# EAGLE design Interconnect_board_v2p0 (EAGLE 9.5.1)
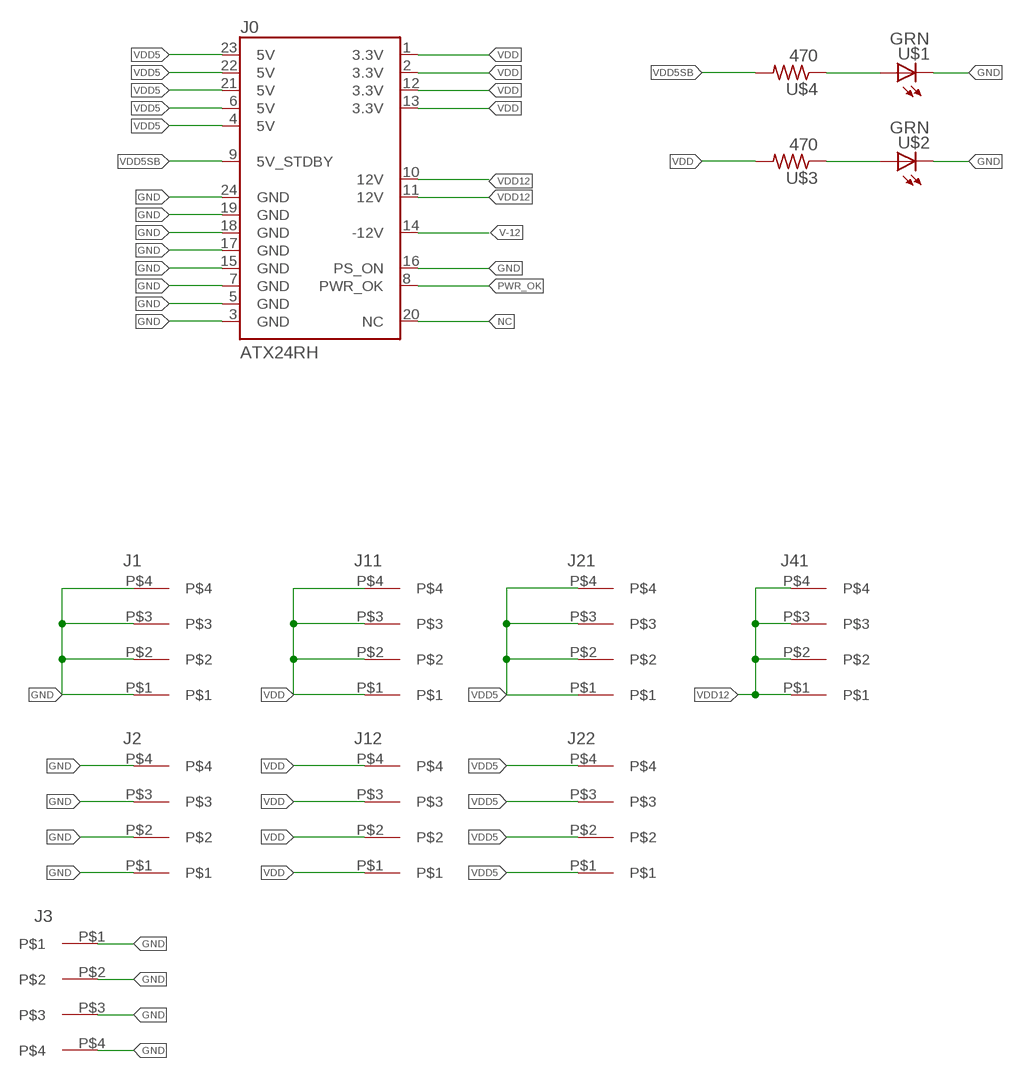
[diagram p0: schematic, sheet 1]

## Parts
J0  ATX24RH  [ATX24_RIGHT_ANGLE]
J1  3.81MM_1_X_4_RT_ANGLE_PLUG_HEADER  [1X4_3.81MM_PITCH]
J2  3.81MM_1_X_4_RT_ANGLE_PLUG_HEADER  [1X4_3.81MM_PITCH]
J3  3.81MM_1_X_4_RT_ANGLE_PLUG_HEADER  [1X4_3.81MM_PITCH]
J11  3.81MM_1_X_4_RT_ANGLE_PLUG_HEADER  [1X4_3.81MM_PITCH]
J12  3.81MM_1_X_4_RT_ANGLE_PLUG_HEADER  [1X4_3.81MM_PITCH]
J21  3.81MM_1_X_4_RT_ANGLE_PLUG_HEADER  [1X4_3.81MM_PITCH]
J22  3.81MM_1_X_4_RT_ANGLE_PLUG_HEADER  [1X4_3.81MM_PITCH]
J41  3.81MM_1_X_4_RT_ANGLE_PLUG_HEADER  [1X4_3.81MM_PITCH]
U$1  LED_0805_GREEN  [LED_0805_GREEN]
U$2  LED_0805_GREEN  [LED_0805_GREEN]
U$3  R_0805_470  [R_0805_470]
U$4  R_0805_470  [R_0805_470]

## Nets
GND: J0.3(GND) J0.5(GND) J0.7(GND) J0.15(GND) J0.16(PS_ON) J0.17(GND) J0.18(GND) J0.19(GND) J0.24(GND) J1.P$1 J1.P$2 J1.P$3 J1.P$4 J2.P$1 J2.P$2 J2.P$3 J2.P$4 J3.P$1 J3.P$2 J3.P$3 J3.P$4 U$1.C U$2.C
N$4: U$1.A U$4.1
N$5: U$2.A U$3.1
NC: J0.20(NC)
PWR_OK: J0.8(PWR_OK)
V-12: J0.14(-12V)
VDD: J0.1(3.3V) J0.2(3.3V) J0.12(3.3V) J0.13(3.3V) J11.P$1 J11.P$2 J11.P$3 J11.P$4 J12.P$1 J12.P$2 J12.P$3 J12.P$4 U$3.2
VDD5: J0.4(5V) J0.6(5V) J0.21(5V) J0.22(5V) J0.23(5V) J21.P$1 J21.P$2 J21.P$3 J21.P$4 J22.P$1 J22.P$2 J22.P$3 J22.P$4
VDD5SB: J0.9(5V_STDBY) U$4.2
VDD12: J0.10(12V) J0.11(12V) J41.P$1 J41.P$2 J41.P$3 J41.P$4

## Library data of the parts
J0 = 3D_MIG_Controller:ATX24: ATX24 Pin Power Supply Connector - Right Angle PTH Mount This is a good connector for connecting a computer power supply to a PCB. It's massive, but provides many amps of power at 5V and 12V. SparkFun Products: SparkFun Benchtop Power Board Kit <https://www.sparkfun.com/products/12867> SparkFun Power Driver Shield Kit <https://www.sparkfun.com/products/10618>; PROD_ID: CONN-09674; SF_ID: PRT-09498
J1-J3 J11 J12 J21 J22 J41 = 3D_MIG_Controller:3.81MM_1_X_4_RT_ANGLE_PLUG_HEADER
U$1 U$2 = 3D_MIG_Controller:LED_0805_GREEN
U$3 U$4 = 3D_MIG_Controller:R_0805_470

## Board
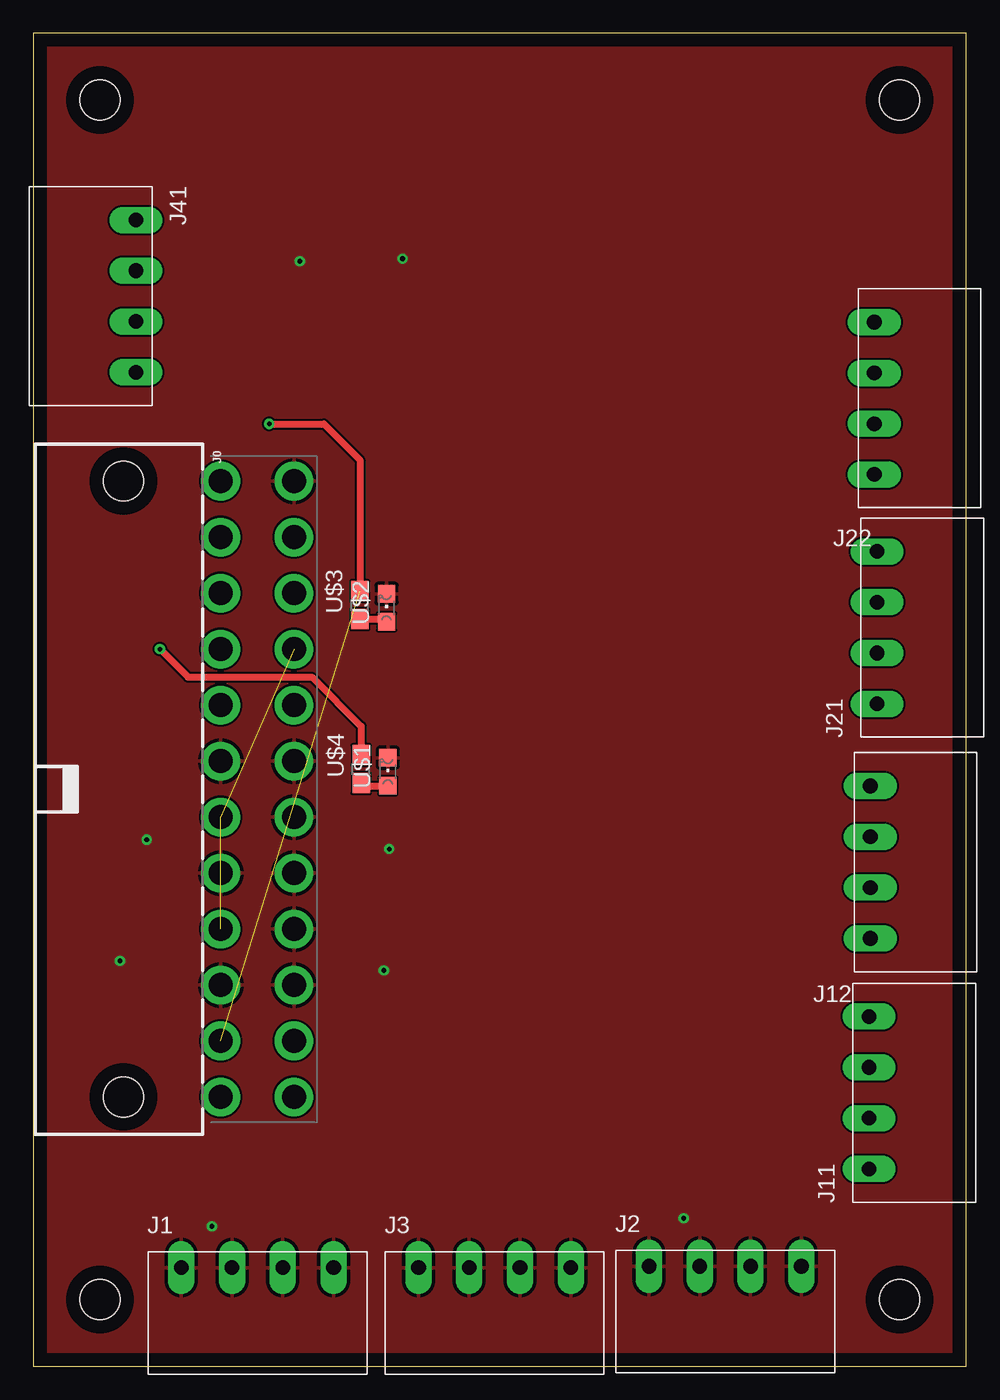
[diagram p1: board, top side]
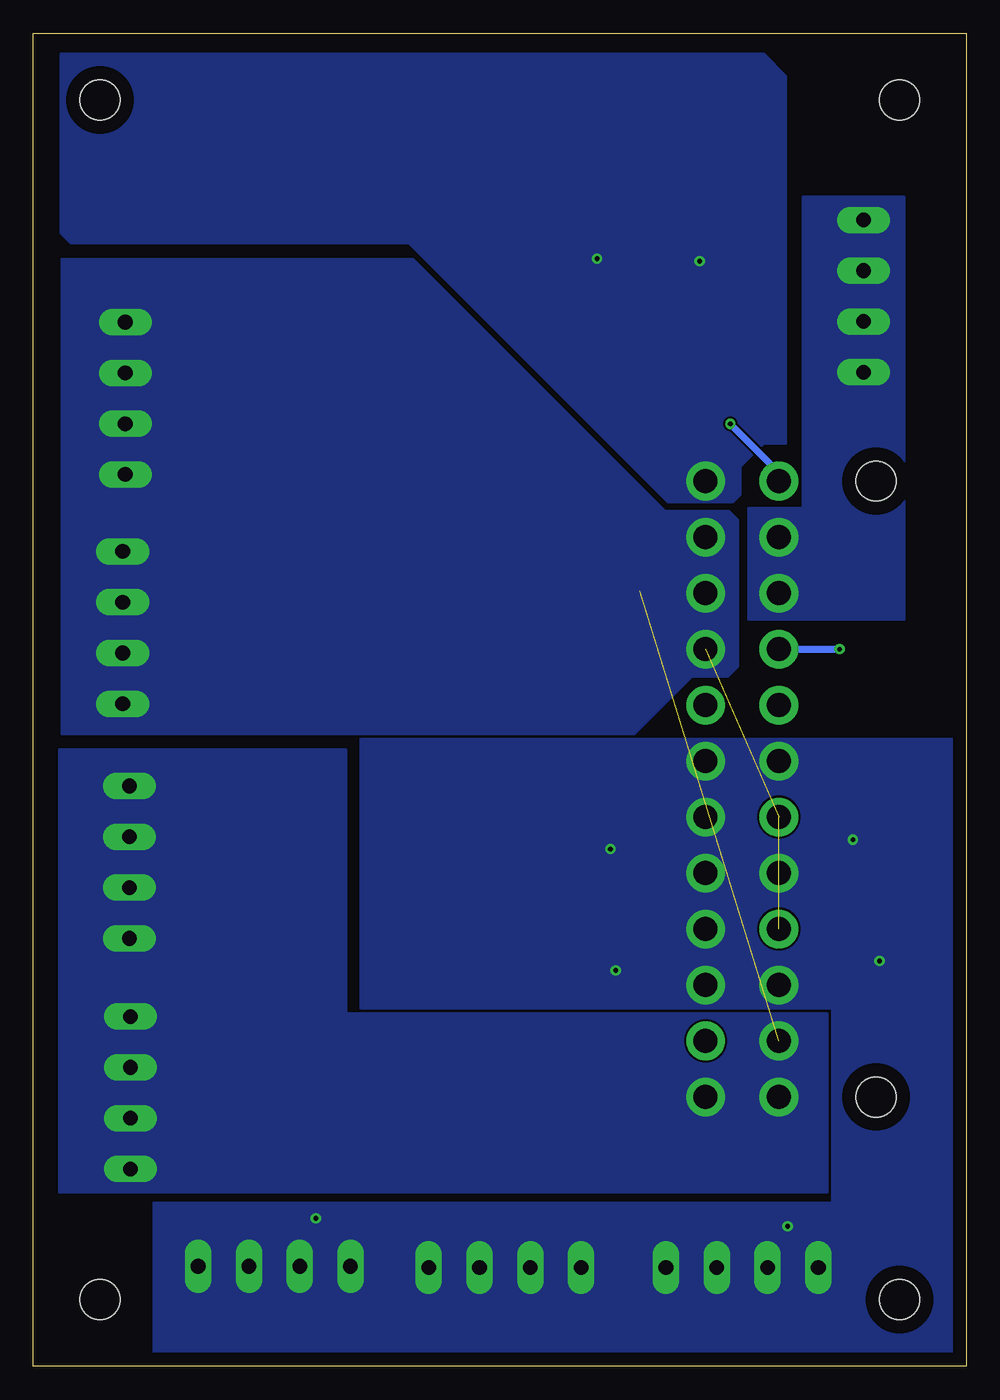
[diagram p2: board, bottom side, seen from below]

Size 70 x 100 mm. Coordinates in mm from the lower left corner, seen from the top.
Outline: 0,0 70,0 70,100 0,100 0,0
Copper layers (1*16): Top 0.035mm / dielectric 1.5mm / Bottom 0.035mm
Design rules "default": minimum track width 6mil, minimum drill 0.35mm, track to track 6mil, track to pad 6mil, pad to pad 6mil, via to via 6mil, smd to smd 6mil, copper to edge 40mil, drill to drill 6mil, minimum pad ring 10mil, minimum via ring 8mil, stop-mask expansion 4mil, vias tented up to drill 0mil, thermal gap 10mil
Holes 3 mm at 5,95 5,5 65,5 65,95

### Footprints (pad centres in the part's own frame; a part is rotated, then mirrored left to right if it is on the bottom)
ATX24_RIGHT_ANGLE = drill 1.8 pad 2.9: 1 23.1,4.76; 2 18.9,4.76; 3 14.7,4.76; 4 10.5,4.76; 5 6.3,4.76; 6 2.1,4.76; 7 -2.1,4.76; 8 -6.3,4.76; 9 -10.5,4.76; 10 -14.7,4.76; 11 -18.9,4.76; 12 -23.1,4.76; 13 23.1,10.26; 14 18.9,10.26; 15 14.7,10.26; 16 10.5,10.26; 17 6.3,10.26; 18 2.1,10.26; 19 -2.1,10.26; 20 -6.3,10.26; 21 -10.5,10.26; 22 -14.7,10.26; 23 -18.9,10.26; 24 -23.1,10.26 | hole 3: -23.1,-2.54; 23.1,-2.54
1X4_3.81MM_PITCH = drill 1.1 pad 2 long: P$1 0,0; P$2 3.81,0; P$3 7.62,0; P$4 11.43,0
LED_0805_GREEN = smd 1.3 x 1.3: A 0,-1.05; C 0,1.05
R_0805_470 = smd 1.5 x 1.3: 1 -1.052,0; 2 1.052,0

### Placement (x,y rotation side)
J0  9.3,43.3 270 top
J1  11.1,7.4 0 top
J2  46.2,7.5 0 top
J3  28.9,7.4 0 top
J11  62.7,14.8 90 top
J12  62.8,32.1 90 top
J21  63.3,49.7 90 top
J22  63.1,66.9 90 top
J41  7.7,86 270 top
U$1  26.6,44.6 0 top
U$2  26.5,56.9 0 top
U$3  24.5,57.1 90 top
U$4  24.6,44.8 90 top

### Tracks (layer width: path | path; a pad name or v marks a point on that pad's centre or on a via)
GND  (via drill 0.35)
  other vias: 48.8,11.1 13.4,10.5 26.3,29.7 6.5,30.4 26.7,38.8 8.5,39.5 20,82.9 27.7,83.1
  pour Bottom (no thermals): 61,12.3 61,0.1 0,0.1 0,47.1 45.5,47.1 45.5,26.8 10.1,26.8 10.1,12.3
  pour Bottom (no thermals): 22.4,64.8 41.8,84.2 67.2,84.2 68,85 68,98.5 15.2,98.5 13.5,96.8 13.5,69.2 15.2,69.2 16.9,67.5 16.9,65.4 17.4,64.9 17.5,64.8
  pour Top: 0,100 70,100 70,0 0,0
N$4
  Top 0.508: U$4.1 24.8,43.55 U$1.A
N$5
  Top 0.508: U$3.1 26.3,56.05 U$2.A
VDD  (via drill 0.35)  (1 unrouted)
  Top 0.508: v17.7,70.7 21.8,70.7 24.5,68 U$3.2
  Bottom 0.508: J0.12 14.06,67.06 v17.7,70.7
  pour Bottom (no thermals): 46.5,26.5 10.4,26.5 10.4,13 68.1,13 68.1,46.3 46.5,46.3
VDD5  (2 unrouted)
  pour Bottom (no thermals): 17.1,63.5 17.8,64.2 22.6,64.2 41.5,83.1 67.9,83.1 67.9,47.4 24.9,47.4 20.6,51.7 17.9,51.7 17.1,52.5
VDD5SB  (via drill 0.35)
  Top 0.508: v9.5,53.8 11.6,51.7 20.9,51.7 24.6,48 U$4.2
  Bottom 0.508: J0.9 v9.5,53.8
VDD12
  pour Bottom (no thermals): 16.4,60.1 16.4,64.4 12.3,64.4 12.3,87.8 4.6,87.8 4.6,56 15.6,56 16.4,56